# Altium project 1.PrjPcb
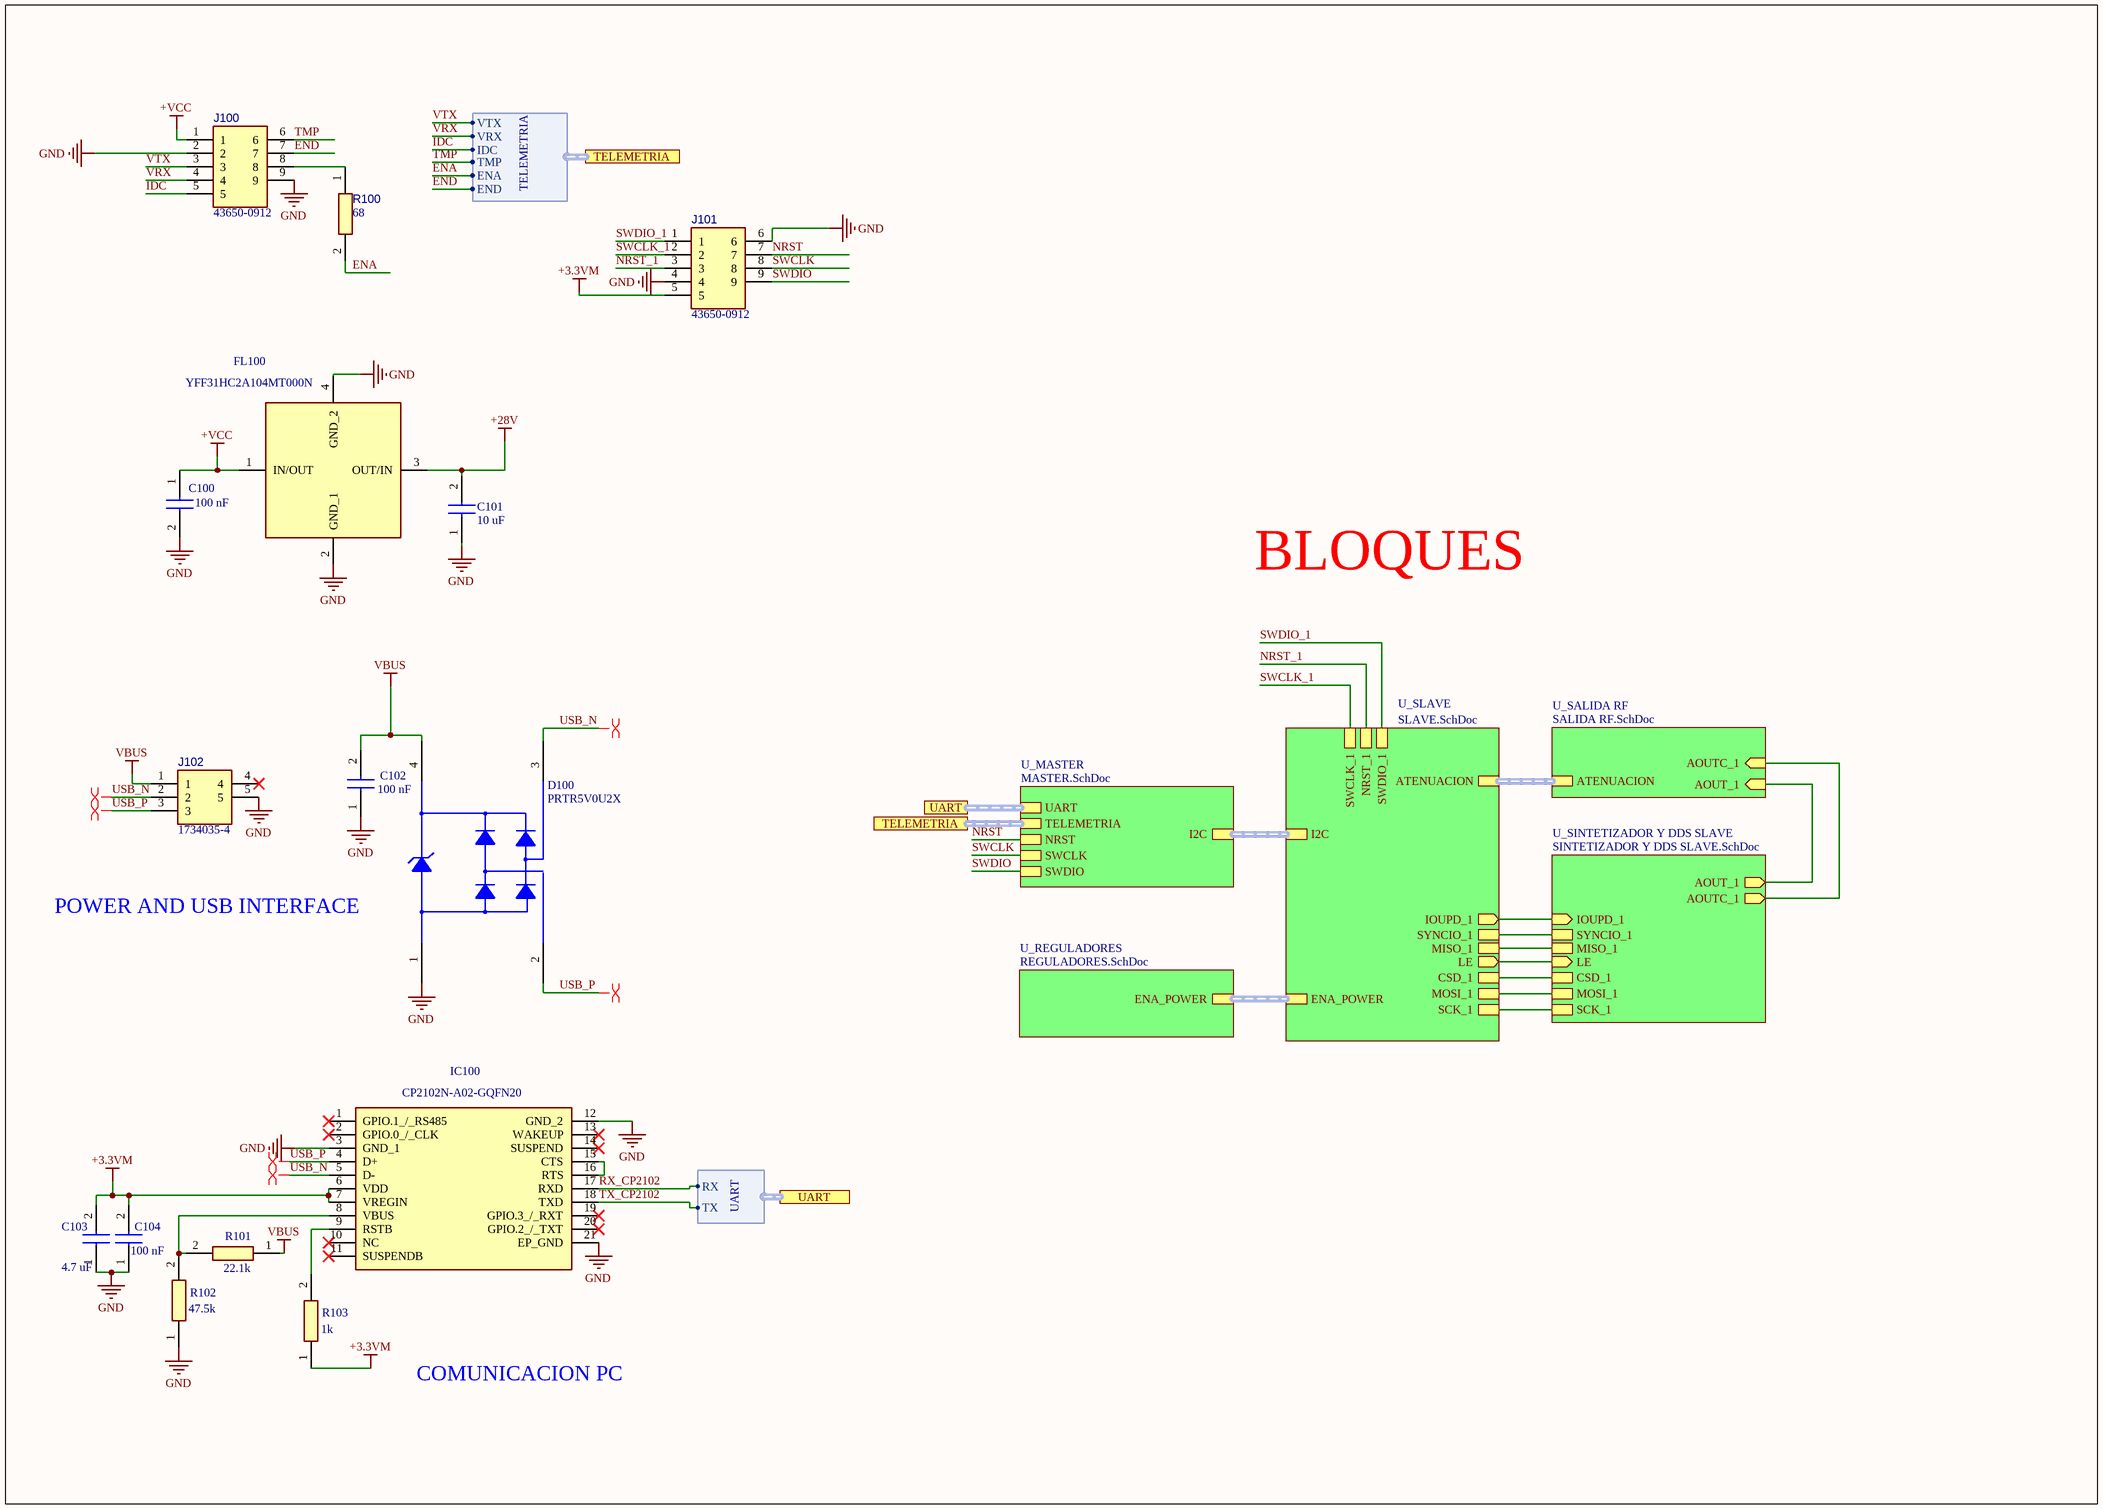
[diagram p0: GENERADORA V1.5.SchDoc]
5 sheets, 98 parts. Net scope: hierarchical (ports join the sheet entries above them; power ports are global).
Board file: GENERADORA V1.5.PcbDoc
Sheets:
  GENERADORA V1.5.SchDoc
    U_SALIDA RF = SALIDA RF.SchDoc
    U_SINTETIZADOR Y DDS SLAVE = SINTETIZADOR Y DDS SLAVE.SchDoc
    U_MASTER = MASTER.SchDoc
    U_SLAVE = SLAVE.SchDoc

## Sheet GENERADORA V1.5.SchDoc
size A3; SheetNumber: 1; SheetTotal: 6

### Parts
C100  100 nF  [CAPC3216X94N]
C101  10 uF  [CAPC3216X94N]
C102  100 nF  [CAPC3216X94N]
C103  4.7 uF  [C0603]
C104  100 nF  [C0603]
D100  PRTR5V0U2X  [AP4-00001]
FL100  YFF31HC2A104MT000N  [YFF31HC2A104MT000N]
IC100  CP2102N-A02-GQFN20  [CP2102NA02GQFN20]
J100  43650-0912  [43650-09(12,13,14)]
J101  43650-0912  [43650-09(12,13,14)]
J102  1734035-4  [1734035-2USB]
R100  68  [RESC1608X55N]
R101  22.1k  [RESC1608X55N]
R102  47.5k  [RESC1608X55N]
R103  1k  [RESC1608X55N]

### Sub-sheets
U_MASTER = MASTER.SchDoc: I2C (harness I2C), UART (harness UART), TELEMETRIA (harness TELEMETRIA), NRST, SWCLK, SWDIO
U_REGULADORES = REGULADORES.SchDoc (file not in this document): ENA_POWER (harness ENA_POWER)
U_SALIDA RF = SALIDA RF.SchDoc: AOUTC_1 (in), AOUT_1 (in), ATENUACION (harness ATENUACION)
U_SINTETIZADOR Y DDS SLAVE = SINTETIZADOR Y DDS SLAVE.SchDoc: AOUTC_1 (out), AOUT_1 (out), CSD_1, SCK_1, MISO_1, SYNCIO_1, MOSI_1, LE (in), IOUPD_1 (in)
U_SLAVE = SLAVE.SchDoc: IOUPD_1 (out), LE (out), I2C (harness I2C), ATENUACION (harness ATENUACION), SWCLK_1, SWDIO_1, NRST_1, ENA_POWER (harness ENA_POWER), CSD_1, MISO_1, MOSI_1, SCK_1, SYNCIO_1

### Ports
TELEMETRIA (harness TELEMETRIA), UART (harness TELEMETRIA), UART (harness UART)

### Harnesses
UART: RX, TX
TELEMETRIA: VTX, VRX, IDC, TMP, ENA, END

### Nets
+3.3VM: C103.2 C104.2 IC100.6(VDD) IC100.7(VREGIN) J101.5 R103.1
+28V: C101.2 FL100.3(OUT/IN)
+VCC: C100.1 FL100.1(IN/OUT) J100.1
GND: C100.2 C101.1 C102.1 C103.1 C104.1 D100.1(GND) FL100.2(GND_1) FL100.4(GND_2) IC100.3(GND_1) IC100.12(GND_2) IC100.21(EP_GND) J100.2 J100.9 J101.4 J101.6 J102.5 R102.1
VBUS: C102.2 D100.4(VCC) J102.1 R101.1
AOUT_1: sheet U_SALIDA RF/AOUT_1, sheet U_SINTETIZADOR Y DDS SLAVE/AOUT_1
AOUTC_1: sheet U_SALIDA RF/AOUTC_1, sheet U_SINTETIZADOR Y DDS SLAVE/AOUTC_1
CSD_1: sheet U_SINTETIZADOR Y DDS SLAVE/CSD_1, sheet U_SLAVE/CSD_1
ENA: R100.2 ; port TELEMETRIA.ENA
END: J100.7 ; port TELEMETRIA.END
IDC: J100.5 ; port TELEMETRIA.IDC
IOUPD_1: sheet U_SINTETIZADOR Y DDS SLAVE/IOUPD_1, sheet U_SLAVE/IOUPD_1
LE: sheet U_SINTETIZADOR Y DDS SLAVE/LE, sheet U_SLAVE/LE
MISO_1: sheet U_SINTETIZADOR Y DDS SLAVE/MISO_1, sheet U_SLAVE/MISO_1
MOSI_1: sheet U_SINTETIZADOR Y DDS SLAVE/MOSI_1, sheet U_SLAVE/MOSI_1
NRST: J101.7 ; sheet U_MASTER/NRST
NRST_1: J101.3 ; sheet U_SLAVE/NRST_1
RX_CP2102: IC100.17(RXD) ; port UART.RX
SCK_1: sheet U_SINTETIZADOR Y DDS SLAVE/SCK_1, sheet U_SLAVE/SCK_1
SWCLK: J101.8 ; sheet U_MASTER/SWCLK
SWCLK_1: J101.2 ; sheet U_SLAVE/SWCLK_1
SWDIO: J101.9 ; sheet U_MASTER/SWDIO
SWDIO_1: J101.1 ; sheet U_SLAVE/SWDIO_1
SYNCIO_1: sheet U_SINTETIZADOR Y DDS SLAVE/SYNCIO_1, sheet U_SLAVE/SYNCIO_1
TMP: J100.6 ; port TELEMETRIA.TMP
TX_CP2102: IC100.18(TXD) ; port UART.TX
USB_N: D100.3(I/O_2) IC100.5(D-) J102.2
USB_P: D100.2(I/O_1) IC100.4(D+) J102.3
VRX: J100.4 ; port TELEMETRIA.VRX
VTX: J100.3 ; port TELEMETRIA.VTX
NetIC100_8: IC100.8(VBUS) R101.2 R102.2
NetIC100_9: IC100.9(RSTB) R103.2
NetIC100_15: IC100.15(CTS) IC100.16(RTS)
NetJ100_8: J100.8 R100.1

Not connected (* = marked no-connect by the designer): IC100 1(GPIO.1_/_RS485)* 2(GPIO.0_/_CLK)* 10(NC)* 11(SUSPENDB)* 13(WAKEUP)* 14(SUSPEND)* 19(GPIO.3_/_RXT)* 20(GPIO.2_/_TXT)*; J102 4*

### Buses and harness runs
harness port TELEMETRIA = sheet U_MASTER/TELEMETRIA
harness port UART = sheet U_MASTER/UART
harness sheet U_MASTER/I2C = sheet U_SLAVE/I2C
harness sheet U_REGULADORES/ENA_POWER = sheet U_SLAVE/ENA_POWER
harness sheet U_SALIDA RF/ATENUACION = sheet U_SLAVE/ATENUACION

### Layout directives
differential pair; differential pair class USB: USB_N, USB_P

### Notes on the sheet
- BLOQUES
- POWER AND USB INTERFACE
- COMUNICACION PC

### Library data of the parts
C100-C102 = KAM31BR81H103KT: Capacitor; Manufacturer_Name: KYOCERA; Datasheet Link: https://datasheets.kyocera-avx.com/AutoMLCCKAM.pdf; Height: 0.94mm; Manufacturer_Part_Number: KAM31BR81H103KT; Mouser Part Number: 581-KAM31BR81H103KT; Mouser Price/Stock: https://www.mouser.co.uk/ProductDetail/KYOCERA-AVX/KAM31BR81H103KT?qs=Jm2GQyTW%2FbjzijSUJGW%2FJA%3D%3D
C103 C104 = C0603H470J5GACTU: Capacitor; Manufacturer_Name: KEMET; Datasheet Link: https://content.kemet.com/datasheets/KEM_C1001_C0G_200C_SMD.pdf; Height: 0.87mm; Manufacturer_Part_Number: C0603H470J5GACTU
D100 = PRTR5V0U2X: Double rail-to-rail USB ESD protection diode; OrcadPartType: Integrated Circuits&Special function&Protection; Manufacturer: Philips; AN: A06-0236; TemperatureRange: -40 to +85 C; Value: PRTR5V0U2X; PartType: Buy; Height: 1,10000002384186; MPN: PRTR5V0U2X
FL100 = YFF31HC2A104MT000N: Filter; Manufacturer_Name: TDK; Datasheet Link: https://product.tdk.com/system/files/dam/doc/product/emc/emc/3tf/catalog/3tf_commercial_power_yff-hc_en.pdf; Height: 1.5mm; Manufacturer_Part_Number: YFF31HC2A104MT000N; Mouser Part Number: 810-YFF31HC2A104MTHN; Mouser Price/Stock: https://www.mouser.co.uk/ProductDetail/TDK/YFF31HC2A104MT000N?qs=1gGcJ6gR7Y2xnDLNcVCkdg%3D%3D; Arrow Part Number: YFF31HC2A104MT000N; Arrow Price/Stock: https://www.arrow.com/en/products/yff31hc2a104mt000n/tdk?region=nac
IC100 = CP2102N-A02-GQFN20: Integrated Circuit; Manufacturer_Name: Silicon Labs; Datasheet Link: https://www.silabs.com/documents/public/data-sheets/cp2102n-datasheet.pdf; Height: 0.8mm; Manufacturer_Part_Number: CP2102N-A02-GQFN20; Mouser Part Number: 634-CP2102NA02GQFN20; Mouser Price/Stock: https://www.mouser.co.uk/ProductDetail/Silicon-Labs/CP2102N-A02-GQFN20?qs=u16ybLDytRaG8WdlP0fT2g%3D%3D; Arrow Part Number: CP2102N-A02-GQFN20; Arrow Price/Stock: https://www.arrow.com/en/products/cp2102n-a02-gqfn20/silicon-labs?region=europe
J100 J101 = 43650-0912: Connector; Manufacturer_Name: Molex; Datasheet Link: https://www.molex.com/pdm_docs/sd/436500212_sd.pdf; Height: 5.57mm; Manufacturer_Part_Number: 43650-0912; Mouser Part Number: 538-43650-0912; Mouser Price/Stock: https://www.mouser.co.uk/ProductDetail/Molex/43650-0912?qs=lm8WgJiVcEuC1RHlaQB4sg%3D%3D
J102 = 1734035-4: Connector; Manufacturer_Name: TE Connectivity; Datasheet Link: http://www.te.com/commerce/DocumentDelivery/DDEController?Action=srchrtrv&DocNm=1734035&DocType=Customer+Drawing&DocLang=English&DocFormat=pdf&PartCntxt=1734035-4; Manufacturer_Part_Number: 1734035-4; Mouser Part Number: 571-1734035-4; Mouser Price/Stock: https://www.mouser.co.uk/ProductDetail/TE-Connectivity/1734035-4?qs=ZYpP4JSRRNCyjylIh5thIQ%3D%3D; Arrow Part Number: 1734035-4; Arrow Price/Stock: https://www.arrow.com/en/products/1734035-4/te-connectivity?region=nac
R100-R103 = CR0603-FX-1431ELF: Resistor; Manufacturer_Name: Bourns; Datasheet Link: https://www.bourns.com/pdfs/chpreztr.pdf; Height: 0.55mm; Manufacturer_Part_Number: CR0603-FX-1431ELF; Mouser Part Number: 652-CR0603FX-1431ELF; Mouser Price/Stock: https://www.mouser.co.uk/ProductDetail/Bourns/CR0603-FX-1431ELF?qs=e7cxVwPieurCzASkAzK2%252Bg%3D%3D

## Sheet SALIDA RF.SchDoc
size A4; SheetNumber: 6; SheetTotal: 6
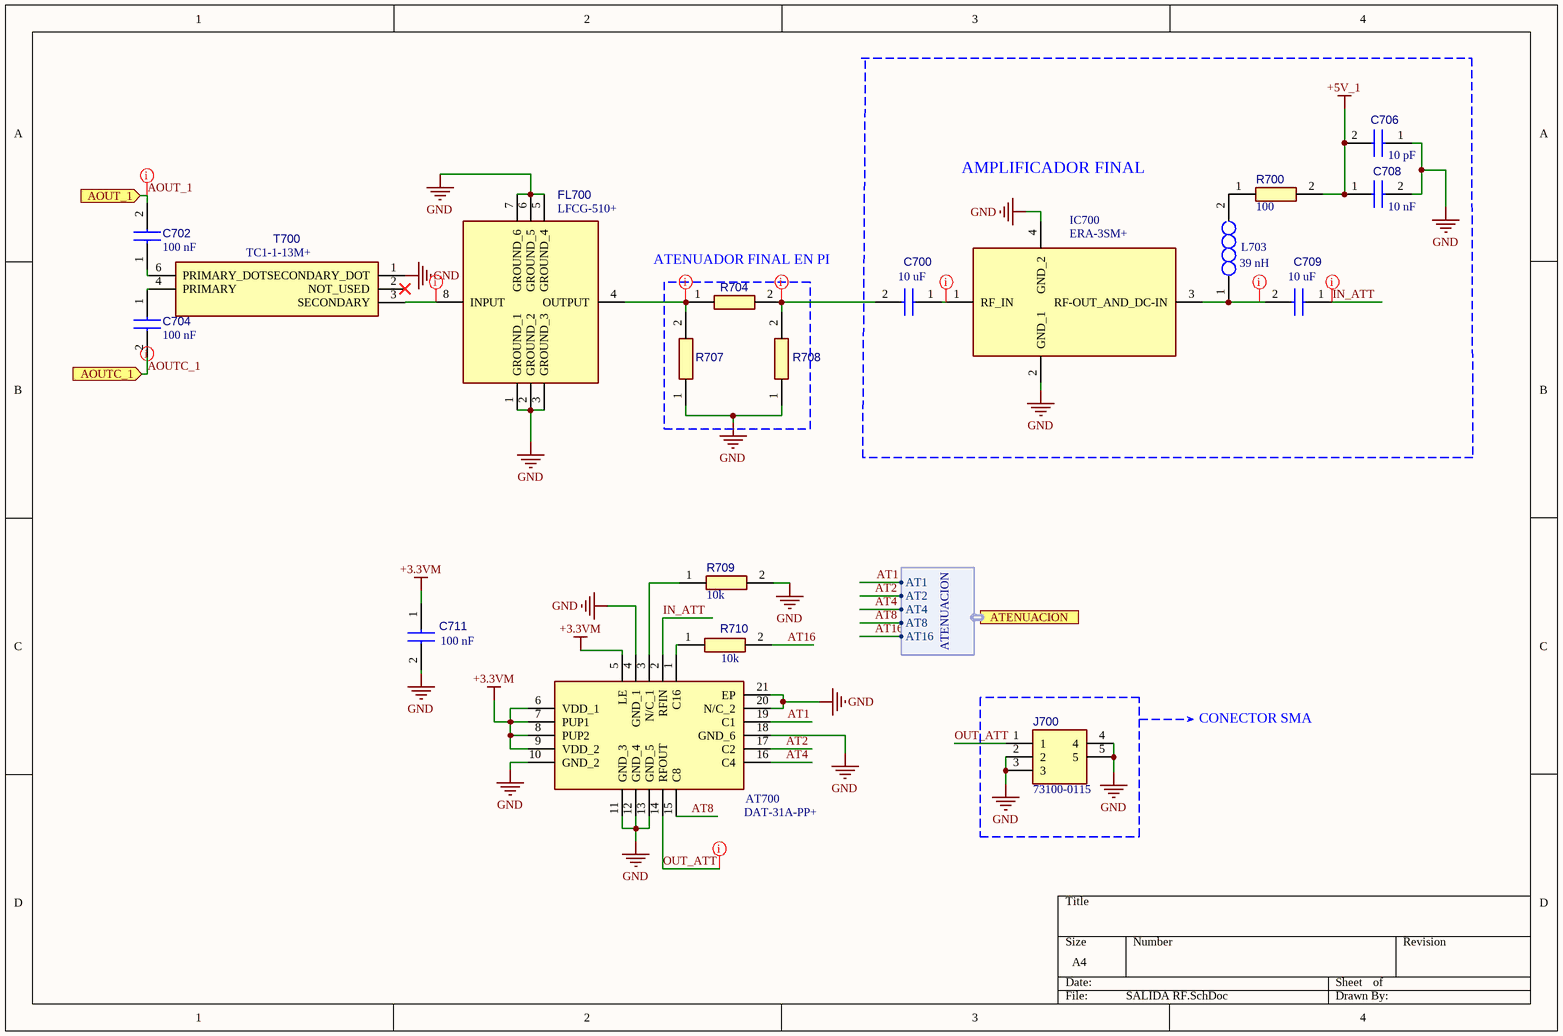
[diagram p1: SALIDA RF.SchDoc]

### Parts
AT700  DAT-31A-PP+  [QFN50P400X400X85-21N]
C700  10 uF  [C0603]
C702  100 nF  [C0603]
C704  100 nF  [C0603]
C706  10 pF  [C0603]
C708  10 nF  [C0603]
C709  10 uF  [C0603]
C711  100 nF  [C0603]
FL700  LFCG-510+  [LFCG2000]
IC700  ERA-3SM+  [ERA3SM]
J700  73100-0115  [731000115]
L703  39 nH  [INDC1608X95N]
R700  100  [RESC1608X55N]
R704  0  [RESC1608X55N]  (value not drawn)
R707  ATENUADOR  [RESC1608X55N]  (value not drawn)
R708  ATENUADOR  [RESC1608X55N]  (value not drawn)
R709  10k  [RESC1608X55N]
R710  10k  [RESC1608X55N]
T700  TC1-1-13M+  [TC414]

### Ports
AOUT_1 (in), AOUTC_1 (in), ATENUACION (harness ATENUACION)

### Harnesses
ATENUACION: AT1, AT2, AT4, AT8, AT16

### Nets
+3.3VM: AT700.5(LE) AT700.6(VDD_1) AT700.7(PUP1) AT700.8(PUP2) AT700.9(VDD_2) C711.1
+5V_1: C706.2 C708.1 R700.2
GND: AT700.4(GND_1) AT700.10(GND_2) AT700.11(GND_3) AT700.12(GND_4) AT700.13(GND_5) AT700.18(GND_6) AT700.20(N/C_2) AT700.21(EP) C706.1 C708.2 C711.2 FL700.1(GROUND_1) FL700.2(GROUND_2) FL700.3(GROUND_3) FL700.5(GROUND_4) FL700.6(GROUND_5) FL700.7(GROUND_6) IC700.2(GND_1) IC700.4(GND_2) J700.2 J700.3 J700.4 J700.5 R707.1 R708.1 R709.2 T700.1(SECONDARY_DOT)
AOUT_1: C702.2 ; port AOUT_1
AOUTC_1: C704.2 ; port AOUTC_1
AT1: AT700.19(C1) ; port ATENUACION.AT1
AT2: AT700.17(C2) ; port ATENUACION.AT2
AT4: AT700.16(C4) ; port ATENUACION.AT4
AT8: AT700.15(C8) ; port ATENUACION.AT8
AT16: R710.2 ; port ATENUACION.AT16
IN_ATT: AT700.2(RFIN) C709.1
OUT_ATT: AT700.14(RFOUT) J700.1
NetAT700_1: AT700.1(C16) R710.1
NetAT700_3: AT700.3(N/C_1) R709.1
NetC700_1: C700.1 IC700.1(RF_IN)
NetC700_2: C700.2 R704.2 R708.2
NetC702_1: C702.1 T700.6(PRIMARY_DOT)
NetC704_1: C704.1 T700.4(PRIMARY)
NetC709_2: C709.2 IC700.3(RF-OUT_AND_DC-IN) L703.1
NetFL700_4: FL700.4(OUTPUT) R704.1 R707.2
NetFL700_8: FL700.8(INPUT) T700.3(SECONDARY)
NetL703_2: L703.2 R700.1

Not connected (* = marked no-connect by the designer): T700 2(NOT_USED)*

### Layout directives
net class RF: AOUT_1, AOUTC_1, IN_ATT, NetC700_1, NetC700_2, NetC709_2, NetFL700_4, NetFL700_8, OUT_ATT

### Notes on the sheet
- AMPLIFICADOR FINAL
- (near R704) ATENUADOR FINAL EN PI
- CONECTOR SMA

### Library data of the parts
AT700 = DAT-31A-PP+: Attenuator or Isolator; Manufacturer_Name: Mini-Circuits; Datasheet Link: https://www.minicircuits.com/pdfs/DAT-31A-PP+.pdf; Height: 0.85mm; Manufacturer_Part_Number: DAT-31A-PP+; Mouser Part Number: 139-DAT-31A-PP+; Mouser Price/Stock: https://www.mouser.co.uk/ProductDetail/Mini-Circuits/DAT-31A-PP%2b?qs=iLbezkQI%252BsipsaaDf6EyAg%3D%3D
C700 C702 C704 C706 C708 C709 C711 = C0603H470J5GACTU: Capacitor; Manufacturer_Name: KEMET; Datasheet Link: https://content.kemet.com/datasheets/KEM_C1001_C0G_200C_SMD.pdf; Height: 0.87mm; Manufacturer_Part_Number: C0603H470J5GACTU
FL700 = LFCG-2000+: Filter; Manufacturer_Name: Mini-Circuits; Datasheet Link: https://www.minicircuits.com/WebStore/dashboardPdf?model=LFCG-2000%2B; Height: 0.95mm; Manufacturer_Part_Number: LFCG-2000+; Mouser Part Number: 139-LFCG-2000+; Mouser Price/Stock: https://www.mouser.co.uk/ProductDetail/Mini-Circuits/LFCG-2000%2b?qs=DRkmTr78QATAEe9U%2FxoX1Q%3D%3D
IC700 = ERA-3SM+: Integrated Circuit; Manufacturer_Name: Mini-Circuits; Datasheet Link: https://www.minicircuits.com/WebStore/dashboard.html?model=ERA-3SM%2B; Height: 1.52mm; Manufacturer_Part_Number: ERA-3SM+; Mouser Part Number: 139-ERA-3SM; Mouser Price/Stock: https://www.mouser.co.uk/ProductDetail/Mini-Circuits/ERA-3SM%2b?qs=xZ%2FP%252Ba9zWqY4QiJxdjLZgw%3D%3D
J700 = 73100-0115: Connector; Manufacturer_Name: Molex; Datasheet Link: https://www.molex.com/pdm_docs/sd/731000115_sd.pdf; Height: 9.57mm; Manufacturer_Part_Number: 73100-0115; Mouser Part Number: 538-73100-0115; Mouser Price/Stock: https://www.mouser.co.uk/ProductDetail/Molex/73100-0115?qs=dxVETAvtHz69wpck%252B7ItSw%3D%3D
L703 = AIML-0603-100K-T: Inductor; Manufacturer_Name: ABRACON; Datasheet Link: https://abracon.com/Magnetics/new/AIML-0603.pdf; Height: 0.95mm; Manufacturer_Part_Number: AIML-0603-100K-T; Mouser Part Number: 815-AIML-0603-100KT; Mouser Price/Stock: https://www.mouser.co.uk/ProductDetail/ABRACON/AIML-0603-100K-T?qs=1vO2EIVe%252BY5tBY%252BpVVThrw%3D%3D; Arrow Part Number: AIML-0603-100K-T; Arrow Price/Stock: https://www.arrow.com/en/products/aiml-0603-100k-t/abracon?region=nac
R700 R704 R707-R710 = CR0603-FX-1431ELF: Resistor; Manufacturer_Name: Bourns; Datasheet Link: https://www.bourns.com/pdfs/chpreztr.pdf; Height: 0.55mm; Manufacturer_Part_Number: CR0603-FX-1431ELF; Mouser Part Number: 652-CR0603FX-1431ELF; Mouser Price/Stock: https://www.mouser.co.uk/ProductDetail/Bourns/CR0603-FX-1431ELF?qs=e7cxVwPieurCzASkAzK2%252Bg%3D%3D
T700 = TC1-1-13M+: Transformer; Manufacturer_Name: Mini-Circuits; Datasheet Link: https://datasheet.datasheetarchive.com/originals/distributors/Datasheets-28/DSA-546322.pdf; Height: 4.06mm; Manufacturer_Part_Number: TC1-1-13M+; Mouser Part Number: 139-TC1-1-13M; Mouser Price/Stock: https://www.mouser.co.uk/ProductDetail/Mini-Circuits/TC1-1-13M%2b?qs=xZ%2FP%252Ba9zWqYek%252BZGAF2fWg%3D%3D

## Sheet SINTETIZADOR Y DDS SLAVE.SchDoc
size A3; SheetNumber: 5; SheetTotal: 6
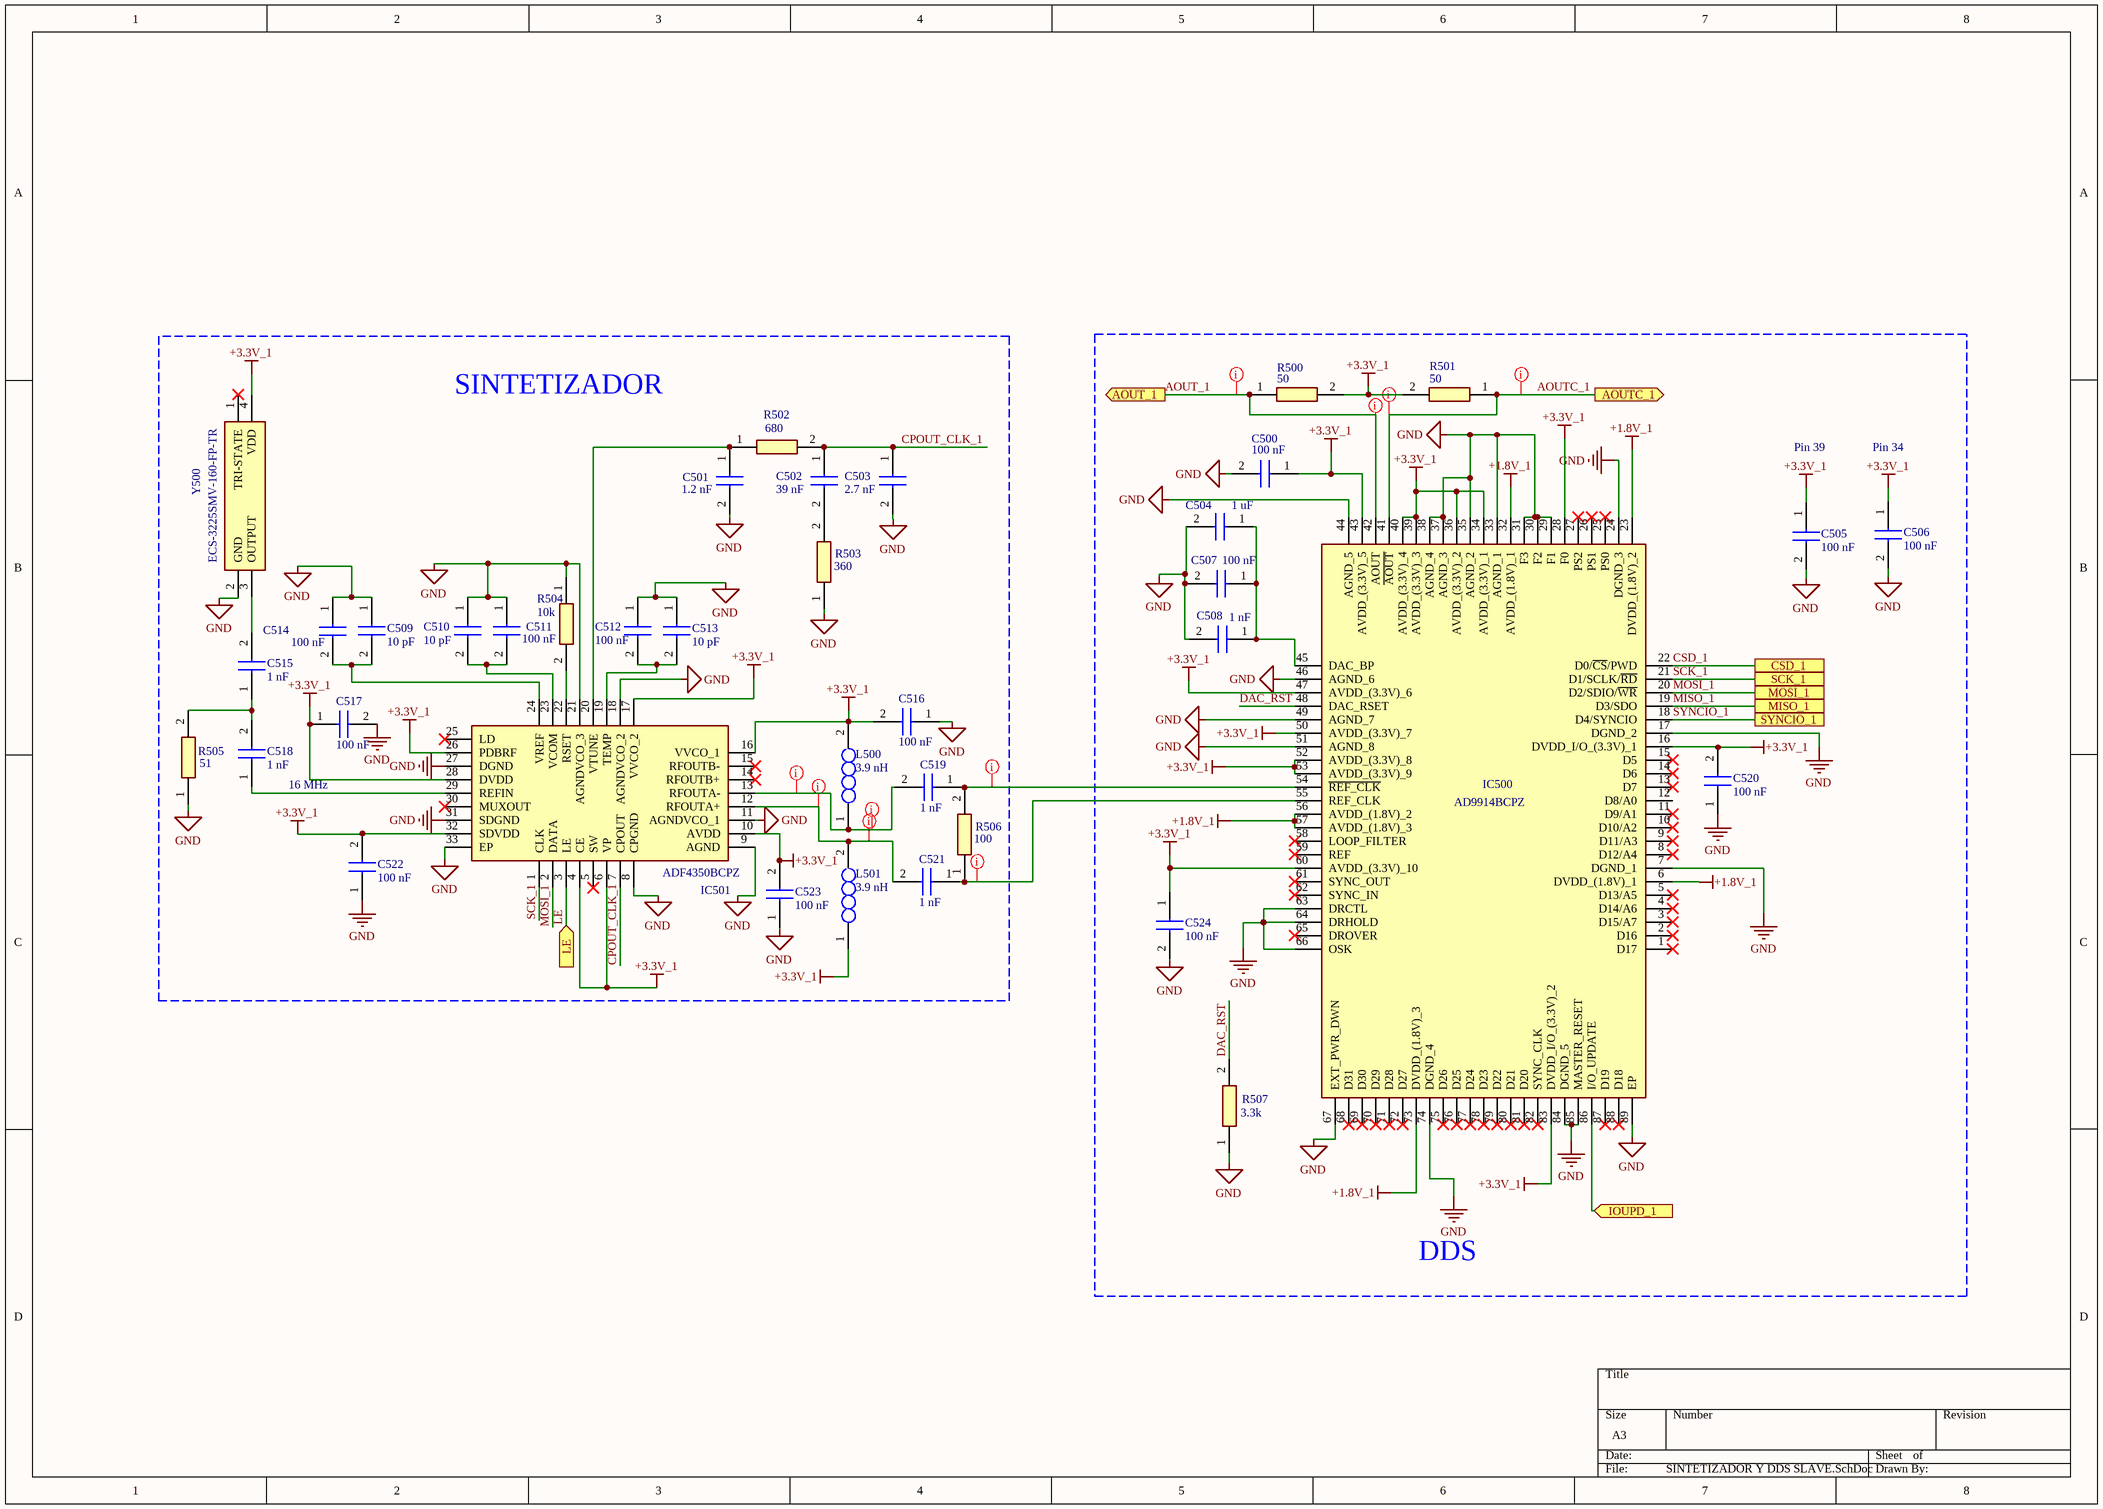
[diagram p2: SINTETIZADOR Y DDS SLAVE.SchDoc]

### Parts
C500  100 nF  [C0603]
C501  1.2 nF  [C0603]
C502  39 nF  [C0603]
C503  2.7 nF  [C0603]
C504  1 uF  [C0603]
C505  100 nF  [C0603]
C506  100 nF  [C0603]
C507  100 nF  [C0603]
C508  1 nF  [C0603]
C509  10 pF  [C0603]
C510  10 pF  [C0603]
C511  100 nF  [C0603]
C512  100 nF  [C0603]
C513  10 pF  [C0603]
C514  100 nF  [C0603]
C515  1 nF  [C0603]
C516  100 nF  [C0603]
C517  100 nF  [C0603]
C518  1 nF  [C0603]
C519  1 nF  [C0603]
C520  100 nF  [C0603]
C521  1 nF  [C0603]
C522  100 nF  [C0603]
C523  100 nF  [C0603]
C524  100 nF  [C0603]
IC500  AD9914BCPZ  [QFN50P1200X1200X90-89N-D]
IC501  ADF4350BCPZ  [QFN50P500X500X100-33N]
L500  3.9 nH  [INDC1608X95N]
L501  3.9 nH  [INDC1608X95N]
R500  50  [RESC1608X55N]
R501  50  [RESC1608X55N]
R502  680  [RESC1608X55N]
R503  360  [RESC1608X55N]
R504  10k  [RESC1608X55N]
R505  51  [RESC1608X55N]
R506  100  [RESC1608X55N]
R507  3.3k  [RESC1608X55N]
Y500  ECS-3225SMV-160-FP-TR  [ECS3225SMV160FPTR]

### Blocks framed on the sheet
SINTETIZADOR: C501-C503 C509-C519 C521-C523 IC501 L500 L501 R502-R506 Y500
DDS: C500 C504-C508 C520 C524 IC500 R500 R501 R507

### Ports
AOUT_1 (out), AOUTC_1 (out), CSD_1, IOUPD_1 (in), LE (in), MISO_1, MOSI_1, SCK_1, SYNCIO_1

### Nets
+1.8V_1: IC500.6(DVDD_(1.8V)_1) IC500.23(DVDD_(1.8V)_2) IC500.32(AVDD_(1.8V)_1) IC500.56(AVDD_(1.8V)_2) IC500.57(AVDD_(1.8V)_3) IC500.73(DVDD_(1.8V)_3)
+3.3V_1: C500.1 C505.1 C506.1 C516.2 C517.1 C520.2 C522.2 C523.2 C524.1 IC500.16(DVDD_I/O_(3.3V)_1) IC500.28(F0) IC500.34(AVDD_(3.3V)_1) IC500.36(AVDD_(3.3V)_2) IC500.39(AVDD_(3.3V)_3) IC500.40(AVDD_(3.3V)_4) IC500.43(AVDD_(3.3V)_5) IC500.47(AVDD_(3.3V)_6) IC500.50(AVDD_(3.3V)_7) IC500.52(AVDD_(3.3V)_8) IC500.53(AVDD_(3.3V)_9) IC500.60(AVDD_(3.3V)_10) IC500.83(DVDD_I/O_(3.3V)_2) IC501.4(CE) IC501.6(VP) IC501.10(AVDD) IC501.16(VVCO_1) IC501.17(VVCO_2) IC501.26(PDBRF) IC501.28(DVDD) IC501.32(SDVDD) L500.2 L501.1 R500.2 R501.2 Y500.4(VDD)
GND: C500.2 C501.2 C503.2 C504.2 C505.2 C506.2 C507.2 C508.2 C509.1 C510.1 C511.1 C512.1 C513.1 C514.1 C516.1 C517.2 C520.1 C522.1 C523.1 C524.2 IC500.7(DGND_1) IC500.17(DGND_2) IC500.24(DGND_3) IC500.29(F1) IC500.30(F2) IC500.31(F3) IC500.33(AGND_1) IC500.35(AGND_2) IC500.37(AGND_3) IC500.38(AGND_4) IC500.44(AGND_5) IC500.46(AGND_6) IC500.49(AGND_7) IC500.51(AGND_8) IC500.63(DRCTL) IC500.64(DRHOLD) IC500.66(OSK) IC500.67(EXT_PWR_DWN) IC500.74(DGND_4) IC500.84(DGND_5) IC500.85(MASTER_RESET) IC500.89(EP) IC501.8(CPGND) IC501.9(AGND) IC501.11(AGNDVCO_1) IC501.18(AGNDVCO_2) IC501.21(AGNDVCO_3) IC501.27(DGND) IC501.31(SDGND) IC501.33(EP) R503.1 R504.1 R505.1 R507.1 Y500.2(GND)
AOUT_1: IC500.42(AOUT) R500.1 ; port AOUT_1
AOUTC_1: IC500.41(~{AOUT}) R501.1 ; port AOUTC_1
CPOUT_CLK_1: C502.1 C503.1 IC501.7(CPOUT) R502.2
CSD_1: IC500.22(D0/~{CS}/PWD) ; port CSD_1
DAC_RST: IC500.48(DAC_RSET) R507.2
IOUPD_1: IC500.86(I/O_UPDATE) ; port IOUPD_1
LE: IC501.3(LE) ; port LE
MISO_1: IC500.19(D3/SDO) ; port MISO_1
MOSI_1: IC500.20(D2/SDIO/~{WR}) IC501.2(DATA) ; port MOSI_1
SCK_1: IC500.21(D1/SCLK/~{RD}) IC501.1(CLK) ; port SCK_1
SYNCIO_1: IC500.18(D4/SYNCIO) ; port SYNCIO_1
NetC501_1: C501.1 IC501.20(VTUNE) R502.1
NetC502_2: C502.2 R503.2
NetC504_1: C504.1 C507.1 C508.1 IC500.45(DAC_BP)
NetC509_2: C509.2 C514.2 IC501.24(VREF)
NetC510_2: C510.2 C511.2 IC501.23(VCOM)
NetC512_2: C512.2 C513.2 IC501.19(TEMP)
NetC515_1: C515.1 C518.2 R505.2
NetC515_2: C515.2 Y500.3(OUTPUT)
NetC518_1: C518.1 IC501.29(REFIN)
NetC519_1: C519.1 IC500.54(~{REF_CLK}) R506.2
NetC519_2: C519.2 IC501.13(RFOUTA-) L500.1
NetC521_1: C521.1 IC500.55(REF_CLK) R506.1
NetC521_2: C521.2 IC501.12(RFOUTA+) L501.2
NetIC501_22: IC501.22(RSET) R504.2

Not connected (* = marked no-connect by the designer): IC500 1(D17)* 2(D16)* 3(D15/A7)* 4(D14/A6)* 5(D13/A5)* 8(D12/A4)* 9(D11/A3)* 10(D10/A2)* 11(D9/A1)* 12(D8/A0) 13(D7)* 14(D6)* 15(D5)* 25(PS0)* 26(PS1)* 27(PS2)* 58(LOOP_FILTER)* 59(REF)* 61(SYNC_OUT)* 62(SYNC_IN)* 65(DROVER)* 68(D31)* 69(D30)* 70(D29)* 71(D28)* 72(D27)* 75(D26)* 76(D25)* 77(D24)* 78(D23)* 79(D22)* 80(D21)* 81(D20)* 82(SYNC_CLK)* 87(D19)* 88(D18)*; IC501 5(SW)* 14(RFOUTB+)* 15(RFOUTB-)* 25(LD)* 30(MUXOUT)*; Y500 1(TRI-STATE)*

### Layout directives
net class RF: AOUT_1, AOUTC_1, NetC519_1, NetC519_2, NetC521_1, NetC521_2

### Notes on the sheet
- Pin 39
- Pin 34
- 16 MHz

### Library data of the parts
C500-C524 = C0603H470J5GACTU: Capacitor; Manufacturer_Name: KEMET; Datasheet Link: https://content.kemet.com/datasheets/KEM_C1001_C0G_200C_SMD.pdf; Height: 0.87mm; Manufacturer_Part_Number: C0603H470J5GACTU
IC500 = AD9914BCPZ: Integrated Circuit; Manufacturer_Name: Analog Devices; Datasheet Link: https://componentsearchengine.com/Datasheets/1/AD9914BCPZ.pdf; Height: 0.9mm; Manufacturer_Part_Number: AD9914BCPZ; Mouser Part Number: 584-AD9914BCPZ; Mouser Price/Stock: https://www.mouser.co.uk/ProductDetail/Analog-Devices/AD9914BCPZ?qs=BpaRKvA4VqHC4wK2pFXfVw%3D%3D; Arrow Part Number: AD9914BCPZ; Arrow Price/Stock: https://www.arrow.com/en/products/ad9914bcpz/analog-devices?region=nac
IC501 = ADF4350BCPZ: Integrated Circuit; Manufacturer_Name: Analog Devices; Datasheet Link: https://datasheet.datasheetarchive.com/originals/distributors/Datasheets-SFU1/DSASFU10004634.pdf; Height: 1mm; Manufacturer_Part_Number: ADF4350BCPZ; Mouser Part Number: 584-ADF4350BCPZ; Mouser Price/Stock: https://www.mouser.co.uk/ProductDetail/Analog-Devices/ADF4350BCPZ?qs=BpaRKvA4VqGt2ZHwONikjQ%3D%3D; Arrow Part Number: ADF4350BCPZ; Arrow Price/Stock: https://www.arrow.com/en/products/adf4350bcpz/analog-devices?region=nac
L500 L501 = AIML-0603-100K-T: Inductor; Manufacturer_Name: ABRACON; Datasheet Link: https://abracon.com/Magnetics/new/AIML-0603.pdf; Height: 0.95mm; Manufacturer_Part_Number: AIML-0603-100K-T; Mouser Part Number: 815-AIML-0603-100KT; Mouser Price/Stock: https://www.mouser.co.uk/ProductDetail/ABRACON/AIML-0603-100K-T?qs=1vO2EIVe%252BY5tBY%252BpVVThrw%3D%3D; Arrow Part Number: AIML-0603-100K-T; Arrow Price/Stock: https://www.arrow.com/en/products/aiml-0603-100k-t/abracon?region=nac
R500-R507 = CR0603-FX-1431ELF: Resistor; Manufacturer_Name: Bourns; Datasheet Link: https://www.bourns.com/pdfs/chpreztr.pdf; Height: 0.55mm; Manufacturer_Part_Number: CR0603-FX-1431ELF; Mouser Part Number: 652-CR0603FX-1431ELF; Mouser Price/Stock: https://www.mouser.co.uk/ProductDetail/Bourns/CR0603-FX-1431ELF?qs=e7cxVwPieurCzASkAzK2%252Bg%3D%3D
Y500 = ECS-3225SMV-160-FP-TR: Crystal or Oscillator; Manufacturer_Name: ECS; Datasheet Link: https://datasheet.datasheetarchive.com/originals/distributors/Datasheets_SAMA/aca54b4a763fa6b74cd8d2921d99cf9f.pdf; Height: 1.2mm; Manufacturer_Part_Number: ECS-3225SMV-160-FP-TR; Mouser Part Number: 520-3225SMV-160-FPT; Mouser Price/Stock: https://www.mouser.co.uk/ProductDetail/ECS/ECS-3225SMV-160-FP-TR?qs=%252B6g0mu59x7IhPTRSFb%2Fsjg%3D%3D; Arrow Part Number: ECS-3225SMV-160-FP-TR; Arrow Price/Stock: https://www.arrow.com/en/products/ecs-3225smv-160-fp-tr/ecs-international?region=nac

## Sheet MASTER.SchDoc
size A4; SheetNumber: 2; SheetTotal: 7
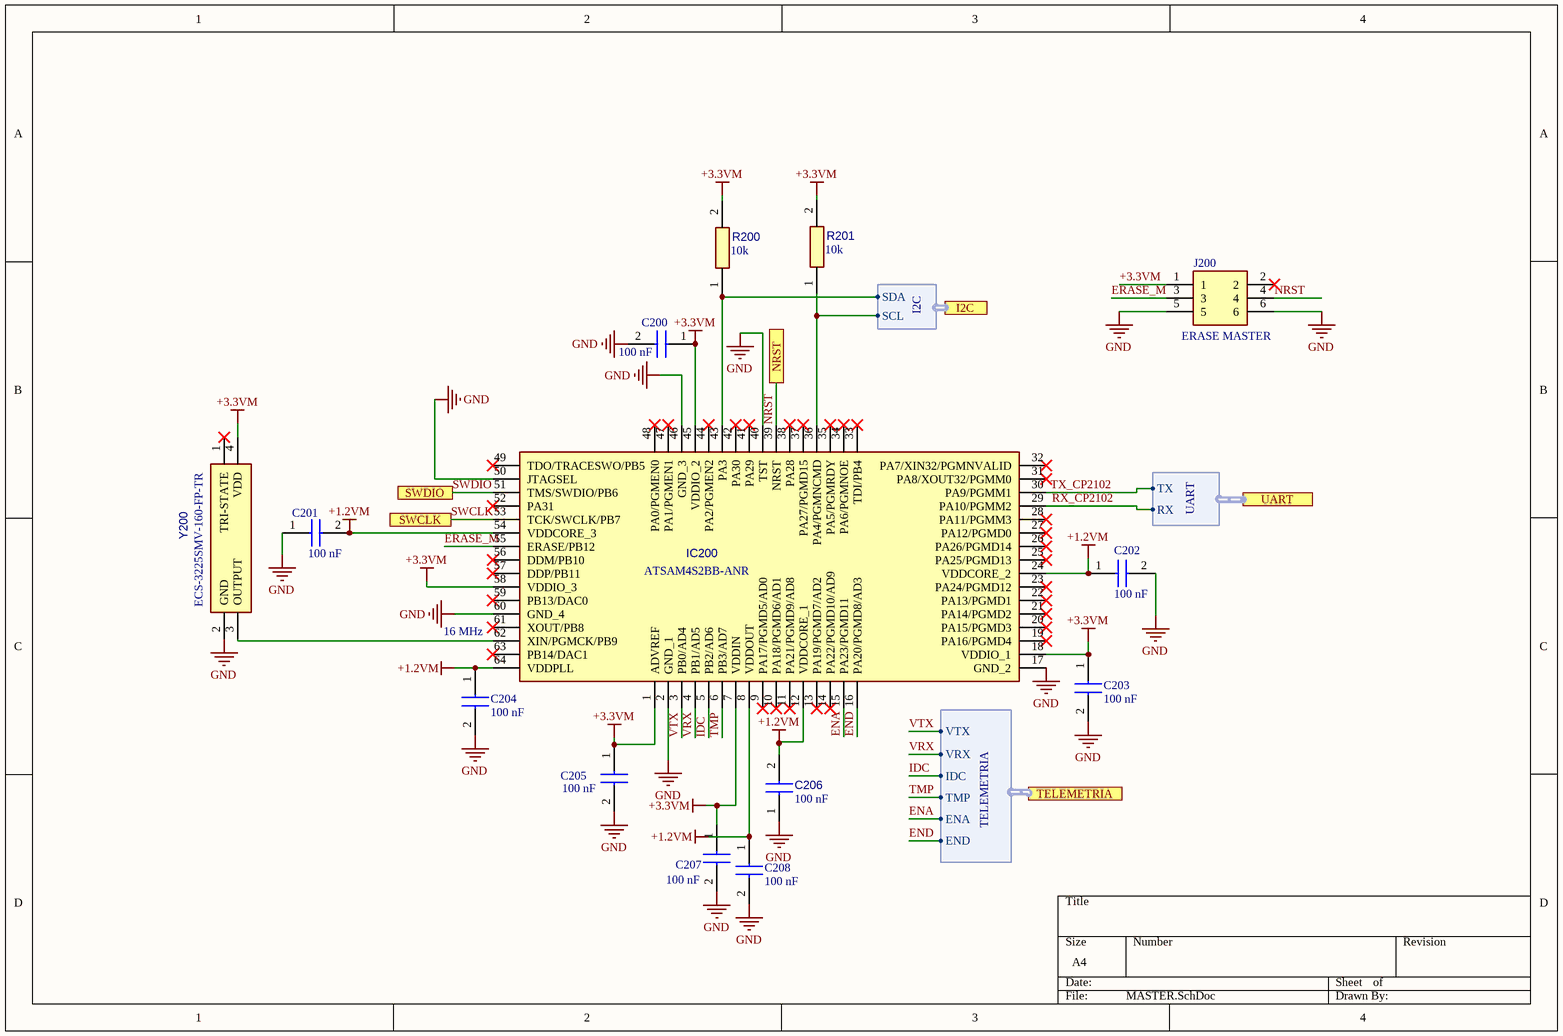
[diagram p3: MASTER.SchDoc]

### Parts
C200  100 nF  [C0603]
C201  100 nF  [C0603]
C202  100 nF  [C0603]
C203  100 nF  [C0603]
C204  100 nF  [C0603]
C205  100 nF  [C0603]
C206  100 nF  [C0603]
C207  100 nF  [C0603]
C208  100 nF  [C0603]
IC200  ATSAM4S2BB-ANR  [QFN50P905X905X75-65N]
J200  ERASE MASTER  [HDRV6W64P254_2X3_762X508X889P]
R200  10k  [RESC1608X55N]
R201  10k  [RESC1608X55N]
Y200  ECS-3225SMV-160-FP-TR  [ECS3225SMV160FPTR]

### Ports
I2C (harness I2C), NRST, SWCLK, SWDIO, TELEMETRIA (harness TELEMETRIA), UART (harness UART)

### Harnesses
I2C: SDA, SCL
UART: TX, RX
TELEMETRIA: VTX, VRX, IDC, TMP, ENA, END

### Nets
+1.2VM: C201.2 C202.1 C204.1 C206.2 C208.1 IC200.8(VDDOUT) IC200.12(VDDCORE_1) IC200.24(VDDCORE_2) IC200.54(VDDCORE_3) IC200.64(VDDPLL)
+3.3VM: C200.1 C203.1 C205.1 C207.1 IC200.1(ADVREF) IC200.7(VDDIN) IC200.18(VDDIO_1) IC200.45(VDDIO_2) IC200.58(VDDIO_3) J200.1 R200.2 R201.2 Y200.4(VDD)
GND: C200.2 C201.1 C202.2 C203.2 C204.2 C205.2 C206.1 C207.2 C208.2 IC200.2(GND_1) IC200.17(GND_2) IC200.40(TST) IC200.46(GND_3) IC200.50(JTAGSEL) IC200.60(GND_4) J200.5 J200.6 Y200.2(GND)
ENA: IC200.15(PA23/PGMD11) ; port TELEMETRIA.ENA
END: IC200.16(PA20/PGMD8/AD3) ; port TELEMETRIA.END
ERASE_M: IC200.55(ERASE/PB12) J200.3
IDC: IC200.5(PB2/AD6) ; port TELEMETRIA.IDC
NRST: IC200.39(NRST) J200.4 ; port NRST
RX_CP2102: IC200.29(PA10/PGMM2) ; port UART.RX
SCL: IC200.36(PA4/PGMNCMD) R201.1 ; port I2C.SCL
SDA: IC200.43(PA3) R200.1 ; port I2C.SDA
SWCLK: IC200.53(TCK/SWCLK/PB7) ; port SWCLK
SWDIO: IC200.51(TMS/SWDIO/PB6) ; port SWDIO
TMP: IC200.6(PB3/AD7) ; port TELEMETRIA.TMP
TX_CP2102: IC200.30(PA9/PGMM1) ; port UART.TX
VRX: IC200.4(PB1/AD5) ; port TELEMETRIA.VRX
VTX: IC200.3(PB0/AD4) ; port TELEMETRIA.VTX
NetIC200_62: IC200.62(XIN/PGMCK/PB9) Y200.3(OUTPUT)

Not connected (* = marked no-connect by the designer): IC200 9(PA17/PGMD5/AD0)* 10(PA18/PGMD6/AD1)* 11(PA21/PGMD9/AD8)* 13(PA19/PGMD7/AD2)* 14(PA22/PGMD10/AD9)* 19(PA16/PGMD4)* 20(PA15/PGMD3)* 21(PA14/PGMD2)* 22(PA13/PGMD1)* 23(PA24/PGMD12)* 25(PA25/PGMD13)* 26(PA26/PGMD14)* 27(PA12/PGMD0)* 28(PA11/PGMM3)* 31(PA8/XOUT32/PGMM0)* 32(PA7/XIN32/PGMNVALID)* 33(TDI/PB4)* 34(PA6/PGMNOE)* 35(PA5/PGMRDY)* 37(PA27/PGMD15)* 38(PA28)* 41(PA29)* 42(PA30)* 44(PA2/PGMEN2)* 47(PA1/PGMEN1)* 48(PA0/PGMEN0)* 49(TDO/TRACESWO/PB5)* 52(PA31)* 56(DDM/PB10)* 57(DDP/PB11)* 59(PB13/DAC0)* 61(XOUT/PB8)* 63(PB14/DAC1)*; J200 2*; Y200 1(TRI-STATE)*

### Notes on the sheet
- 16 MHz

### Library data of the parts
C200-C208 = C0603H470J5GACTU: Capacitor; Manufacturer_Name: KEMET; Datasheet Link: https://content.kemet.com/datasheets/KEM_C1001_C0G_200C_SMD.pdf; Height: 0.87mm; Manufacturer_Part_Number: C0603H470J5GACTU
IC200 = ATSAM4S2BB-ANR: Integrated Circuit; Manufacturer_Name: Microchip; Datasheet Link: https://www.arrow.com/en/products/atsam4s2bb-anr/microchip-technology; Height: 1.6mm; Manufacturer_Part_Number: ATSAM4S2BB-ANR; Mouser Part Number: 556-ATSAM4S2BB-ANR; Mouser Price/Stock: https://www.mouser.co.uk/ProductDetail/Microchip-Technology/ATSAM4S2BB-ANR?qs=YCa%2FAAYMW01XwEtU%252BP2dsA%3D%3D; Arrow Part Number: ATSAM4S2BB-ANR; Arrow Price/Stock: https://www.arrow.com/en/products/atsam4s2bb-anr/microchip-technology
J200 = 61300621121: Connector; Manufacturer_Name: Wurth Elektronik; Height: 8.89mm; Manufacturer_Part_Number: 61300621121; Mouser Part Number: 710-61300621121; Mouser Price/Stock: https://www.mouser.co.uk/ProductDetail/Wurth-Elektronik/61300621121?qs=PhR8RmCirEb94hrEcn0AQg%3D%3D
R200 R201 = CR0603-FX-1431ELF: Resistor; Manufacturer_Name: Bourns; Datasheet Link: https://www.bourns.com/pdfs/chpreztr.pdf; Height: 0.55mm; Manufacturer_Part_Number: CR0603-FX-1431ELF; Mouser Part Number: 652-CR0603FX-1431ELF; Mouser Price/Stock: https://www.mouser.co.uk/ProductDetail/Bourns/CR0603-FX-1431ELF?qs=e7cxVwPieurCzASkAzK2%252Bg%3D%3D
Y200 = ECS-3225SMV-160-FP-TR: as Y500 on sheet SINTETIZADOR Y DDS SLAVE; Datasheet Link: https://datasheet.datasheetarchive.com/originals/distributors/Datasheets_SAMA/aca54b4a763fa6b74cd8d2921d99cf9f.pdf; Height: 1.2mm; Manufacturer_Part_Number: ECS-3225SMV-160-FP-TR; Mouser Part Number: 520-3225SMV-160-FPT; Mouser Price/Stock: https://www.mouser.co.uk/ProductDetail/ECS/ECS-3225SMV-160-FP-TR?qs=%252B6g0mu59x7IhPTRSFb%2Fsjg%3D%3D; Arrow Part Number: ECS-3225SMV-160-FP-TR; Arrow Price/Stock: https://www.arrow.com/en/products/ecs-3225smv-160-fp-tr/ecs-international?region=nac

## Sheet SLAVE.SchDoc
size A4; SheetNumber: 3; SheetTotal: 6
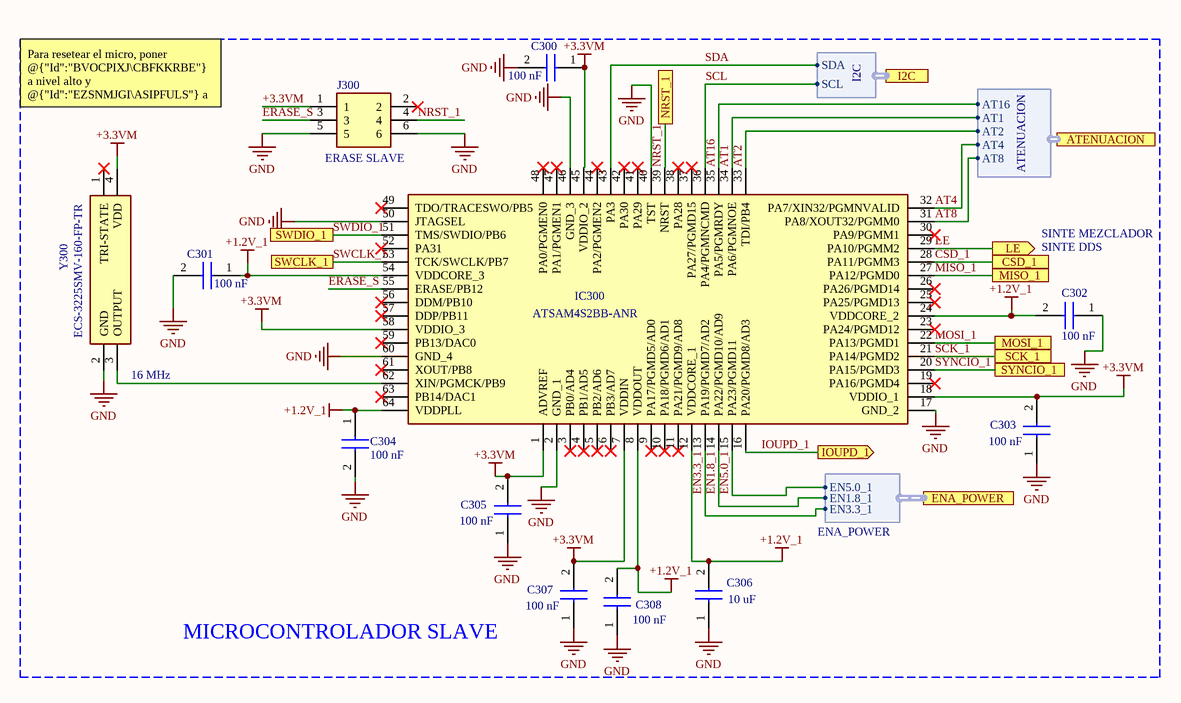
[diagram p4: SLAVE.SchDoc]

### Parts
C300  100 nF  [C0603]
C301  100 nF  [C0603]
C302  100 nF  [C0603]
C303  100 nF  [C0603]
C304  100 nF  [C0603]
C305  100 nF  [C0603]
C306  10 uF  [C0603]
C307  100 nF  [C0603]
C308  100 nF  [C0603]
IC300  ATSAM4S2BB-ANR  [QFN50P905X905X75-65N]
J300  ERASE SLAVE  [HDRV6W64P254_2X3_762X508X889P]
Y300  ECS-3225SMV-160-FP-TR  [ECS3225SMV160FPTR]

### Ports
ATENUACION (harness ATENUACION), CSD_1, ENA_POWER (harness ENA_POWER), I2C (harness I2C), IOUPD_1 (out), LE (out), MISO_1, MOSI_1, NRST_1, SCK_1, SWCLK_1, SWDIO_1, SYNCIO_1

### Harnesses
I2C: SDA, SCL
ATENUACION: AT16, AT1, AT2, AT4, AT8
ENA_POWER: EN5.0_1, EN1.8_1, EN3.3_1

### Nets
+1.2V_1: C301.1 C302.2 C304.1 C306.2 C308.2 IC300.8(VDDOUT) IC300.12(VDDCORE_1) IC300.24(VDDCORE_2) IC300.54(VDDCORE_3) IC300.64(VDDPLL)
+3.3VM: C300.1 C303.2 C305.2 C307.2 IC300.1(ADVREF) IC300.7(VDDIN) IC300.18(VDDIO_1) IC300.45(VDDIO_2) IC300.58(VDDIO_3) J300.1 Y300.4(VDD)
GND: C300.2 C301.2 C302.1 C303.1 C304.2 C305.1 C306.1 C307.1 C308.1 IC300.2(GND_1) IC300.17(GND_2) IC300.40(TST) IC300.46(GND_3) IC300.50(JTAGSEL) IC300.60(GND_4) J300.5 J300.6 Y300.2(GND)
AT1: IC300.34(PA6/PGMNOE) ; port ATENUACION.AT1
AT2: IC300.33(TDI/PB4) ; port ATENUACION.AT2
AT4: IC300.32(PA7/XIN32/PGMNVALID) ; port ATENUACION.AT4
AT8: IC300.31(PA8/XOUT32/PGMM0) ; port ATENUACION.AT8
AT16: IC300.35(PA5/PGMRDY) ; port ATENUACION.AT16
CSD_1: IC300.28(PA11/PGMM3) ; port CSD_1
EN1.8_1: IC300.14(PA22/PGMD10/AD9) ; port ENA_POWER.EN1.8_1
EN3.3_1: IC300.13(PA19/PGMD7/AD2) ; port ENA_POWER.EN3.3_1
EN5.0_1: IC300.15(PA23/PGMD11) ; port ENA_POWER.EN5.0_1
ERASE_S: IC300.55(ERASE/PB12) J300.3
IOUPD_1: IC300.16(PA20/PGMD8/AD3) ; port IOUPD_1
LE: IC300.29(PA10/PGMM2) ; port LE
MISO_1: IC300.27(PA12/PGMD0) ; port MISO_1
MOSI_1: IC300.22(PA13/PGMD1) ; port MOSI_1
NRST_1: IC300.39(NRST) J300.4 ; port NRST_1
SCK_1: IC300.21(PA14/PGMD2) ; port SCK_1
SCL: IC300.36(PA4/PGMNCMD) ; port I2C.SCL
SDA: IC300.43(PA3) ; port I2C.SDA
SWCLK_1: IC300.53(TCK/SWCLK/PB7) ; port SWCLK_1
SWDIO_1: IC300.51(TMS/SWDIO/PB6) ; port SWDIO_1
SYNCIO_1: IC300.20(PA15/PGMD3) ; port SYNCIO_1
NetIC300_62: IC300.62(XIN/PGMCK/PB9) Y300.3(OUTPUT)

Not connected (* = marked no-connect by the designer): IC300 3(PB0/AD4)* 4(PB1/AD5)* 5(PB2/AD6)* 6(PB3/AD7)* 9(PA17/PGMD5/AD0)* 10(PA18/PGMD6/AD1)* 11(PA21/PGMD9/AD8)* 19(PA16/PGMD4)* 23(PA24/PGMD12)* 25(PA25/PGMD13)* 26(PA26/PGMD14)* 30(PA9/PGMM1)* 37(PA27/PGMD15)* 38(PA28)* 41(PA29)* 42(PA30)* 44(PA2/PGMEN2)* 47(PA1/PGMEN1)* 48(PA0/PGMEN0)* 49(TDO/TRACESWO/PB5)* 52(PA31)* 56(DDM/PB10)* 57(DDP/PB11)* 59(PB13/DAC0)* 61(XOUT/PB8)* 63(PB14/DAC1)*; J300 2*; Y300 1(TRI-STATE)*

### Notes on the sheet
- Para resetear el micro, poner @{"Id":"BVOCPIXJ\CBFKKRBE"} a nivel alto y @{"Id":"EZSNMJGI\ASIPFULS"} a nivel bajo. En reposo, colocar @{"Id":"BVOCPIXJ\CBFKKRBE"} a nivel bajo y @{"Id":"EZSNMJGI\ASIPFULS"} en vacio.
- SINTE MEZCLADOR
- SINTE DDS
- (near Y300) 16 MHz
- MICROCONTROLADOR SLAVE

### Library data of the parts
C300-C308 = C0603H470J5GACTU: Capacitor; Manufacturer_Name: KEMET; Datasheet Link: https://content.kemet.com/datasheets/KEM_C1001_C0G_200C_SMD.pdf; Height: 0.87mm; Manufacturer_Part_Number: C0603H470J5GACTU
IC300 = ATSAM4S2BB-ANR: as IC200 on sheet MASTER; Datasheet Link: https://www.arrow.com/en/products/atsam4s2bb-anr/microchip-technology; Height: 1.6mm; Manufacturer_Part_Number: ATSAM4S2BB-ANR; Mouser Part Number: 556-ATSAM4S2BB-ANR; Mouser Price/Stock: https://www.mouser.co.uk/ProductDetail/Microchip-Technology/ATSAM4S2BB-ANR?qs=YCa%2FAAYMW01XwEtU%252BP2dsA%3D%3D; Arrow Part Number: ATSAM4S2BB-ANR; Arrow Price/Stock: https://www.arrow.com/en/products/atsam4s2bb-anr/microchip-technology
J300 = 61300621121: as J200 on sheet MASTER; Height: 8.89mm; Manufacturer_Part_Number: 61300621121; Mouser Part Number: 710-61300621121; Mouser Price/Stock: https://www.mouser.co.uk/ProductDetail/Wurth-Elektronik/61300621121?qs=PhR8RmCirEb94hrEcn0AQg%3D%3D
Y300 = ECS-3225SMV-160-FP-TR: as Y500 on sheet SINTETIZADOR Y DDS SLAVE; Datasheet Link: https://datasheet.datasheetarchive.com/originals/distributors/Datasheets_SAMA/aca54b4a763fa6b74cd8d2921d99cf9f.pdf; Height: 1.2mm; Manufacturer_Part_Number: ECS-3225SMV-160-FP-TR; Mouser Part Number: 520-3225SMV-160-FPT; Mouser Price/Stock: https://www.mouser.co.uk/ProductDetail/ECS/ECS-3225SMV-160-FP-TR?qs=%252B6g0mu59x7IhPTRSFb%2Fsjg%3D%3D; Arrow Part Number: ECS-3225SMV-160-FP-TR; Arrow Price/Stock: https://www.arrow.com/en/products/ecs-3225smv-160-fp-tr/ecs-international?region=nac

## Nets that join several sheets
+3.3VM: GENERADORA V1.5 (6 pins), SALIDA RF (6 pins), MASTER (13 pins), SLAVE (11 pins)
GND: GENERADORA V1.5 (17 pins), SALIDA RF (27 pins), SINTETIZADOR Y DDS SLAVE (55 pins), MASTER (18 pins), SLAVE (18 pins)
AOUT_1: SALIDA RF (C702.2), SINTETIZADOR Y DDS SLAVE (IC500.42 R500.1)
AOUTC_1: SALIDA RF (C704.2), SINTETIZADOR Y DDS SLAVE (IC500.41 R501.1)
AT1: SALIDA RF (AT700.19), SLAVE (IC300.34)
AT2: SALIDA RF (AT700.17), SLAVE (IC300.33)
AT4: SALIDA RF (AT700.16), SLAVE (IC300.32)
AT8: SALIDA RF (AT700.15), SLAVE (IC300.31)
AT16: SALIDA RF (R710.2), SLAVE (IC300.35)
CSD_1: SINTETIZADOR Y DDS SLAVE (IC500.22), SLAVE (IC300.28)
ENA: GENERADORA V1.5 (R100.2), MASTER (IC200.15)
END: GENERADORA V1.5 (J100.7), MASTER (IC200.16)
IDC: GENERADORA V1.5 (J100.5), MASTER (IC200.5)
IOUPD_1: SINTETIZADOR Y DDS SLAVE (IC500.86), SLAVE (IC300.16)
LE: SINTETIZADOR Y DDS SLAVE (IC501.3), SLAVE (IC300.29)
MISO_1: SINTETIZADOR Y DDS SLAVE (IC500.19), SLAVE (IC300.27)
MOSI_1: SINTETIZADOR Y DDS SLAVE (IC500.20 IC501.2), SLAVE (IC300.22)
NRST: GENERADORA V1.5 (J101.7), MASTER (IC200.39 J200.4)
NRST_1: GENERADORA V1.5 (J101.3), SLAVE (IC300.39 J300.4)
RX_CP2102: GENERADORA V1.5 (IC100.17), MASTER (IC200.29)
SCK_1: SINTETIZADOR Y DDS SLAVE (IC500.21 IC501.1), SLAVE (IC300.21)
SCL: MASTER (IC200.36 R201.1), SLAVE (IC300.36)
SDA: MASTER (IC200.43 R200.1), SLAVE (IC300.43)
SWCLK: GENERADORA V1.5 (J101.8), MASTER (IC200.53)
SWCLK_1: GENERADORA V1.5 (J101.2), SLAVE (IC300.53)
SWDIO: GENERADORA V1.5 (J101.9), MASTER (IC200.51)
SWDIO_1: GENERADORA V1.5 (J101.1), SLAVE (IC300.51)
SYNCIO_1: SINTETIZADOR Y DDS SLAVE (IC500.18), SLAVE (IC300.20)
TMP: GENERADORA V1.5 (J100.6), MASTER (IC200.6)
TX_CP2102: GENERADORA V1.5 (IC100.18), MASTER (IC200.30)
VRX: GENERADORA V1.5 (J100.4), MASTER (IC200.4)
VTX: GENERADORA V1.5 (J100.3), MASTER (IC200.3)